# EAGLE schematic MagEnc2 (EAGLE 6.2)
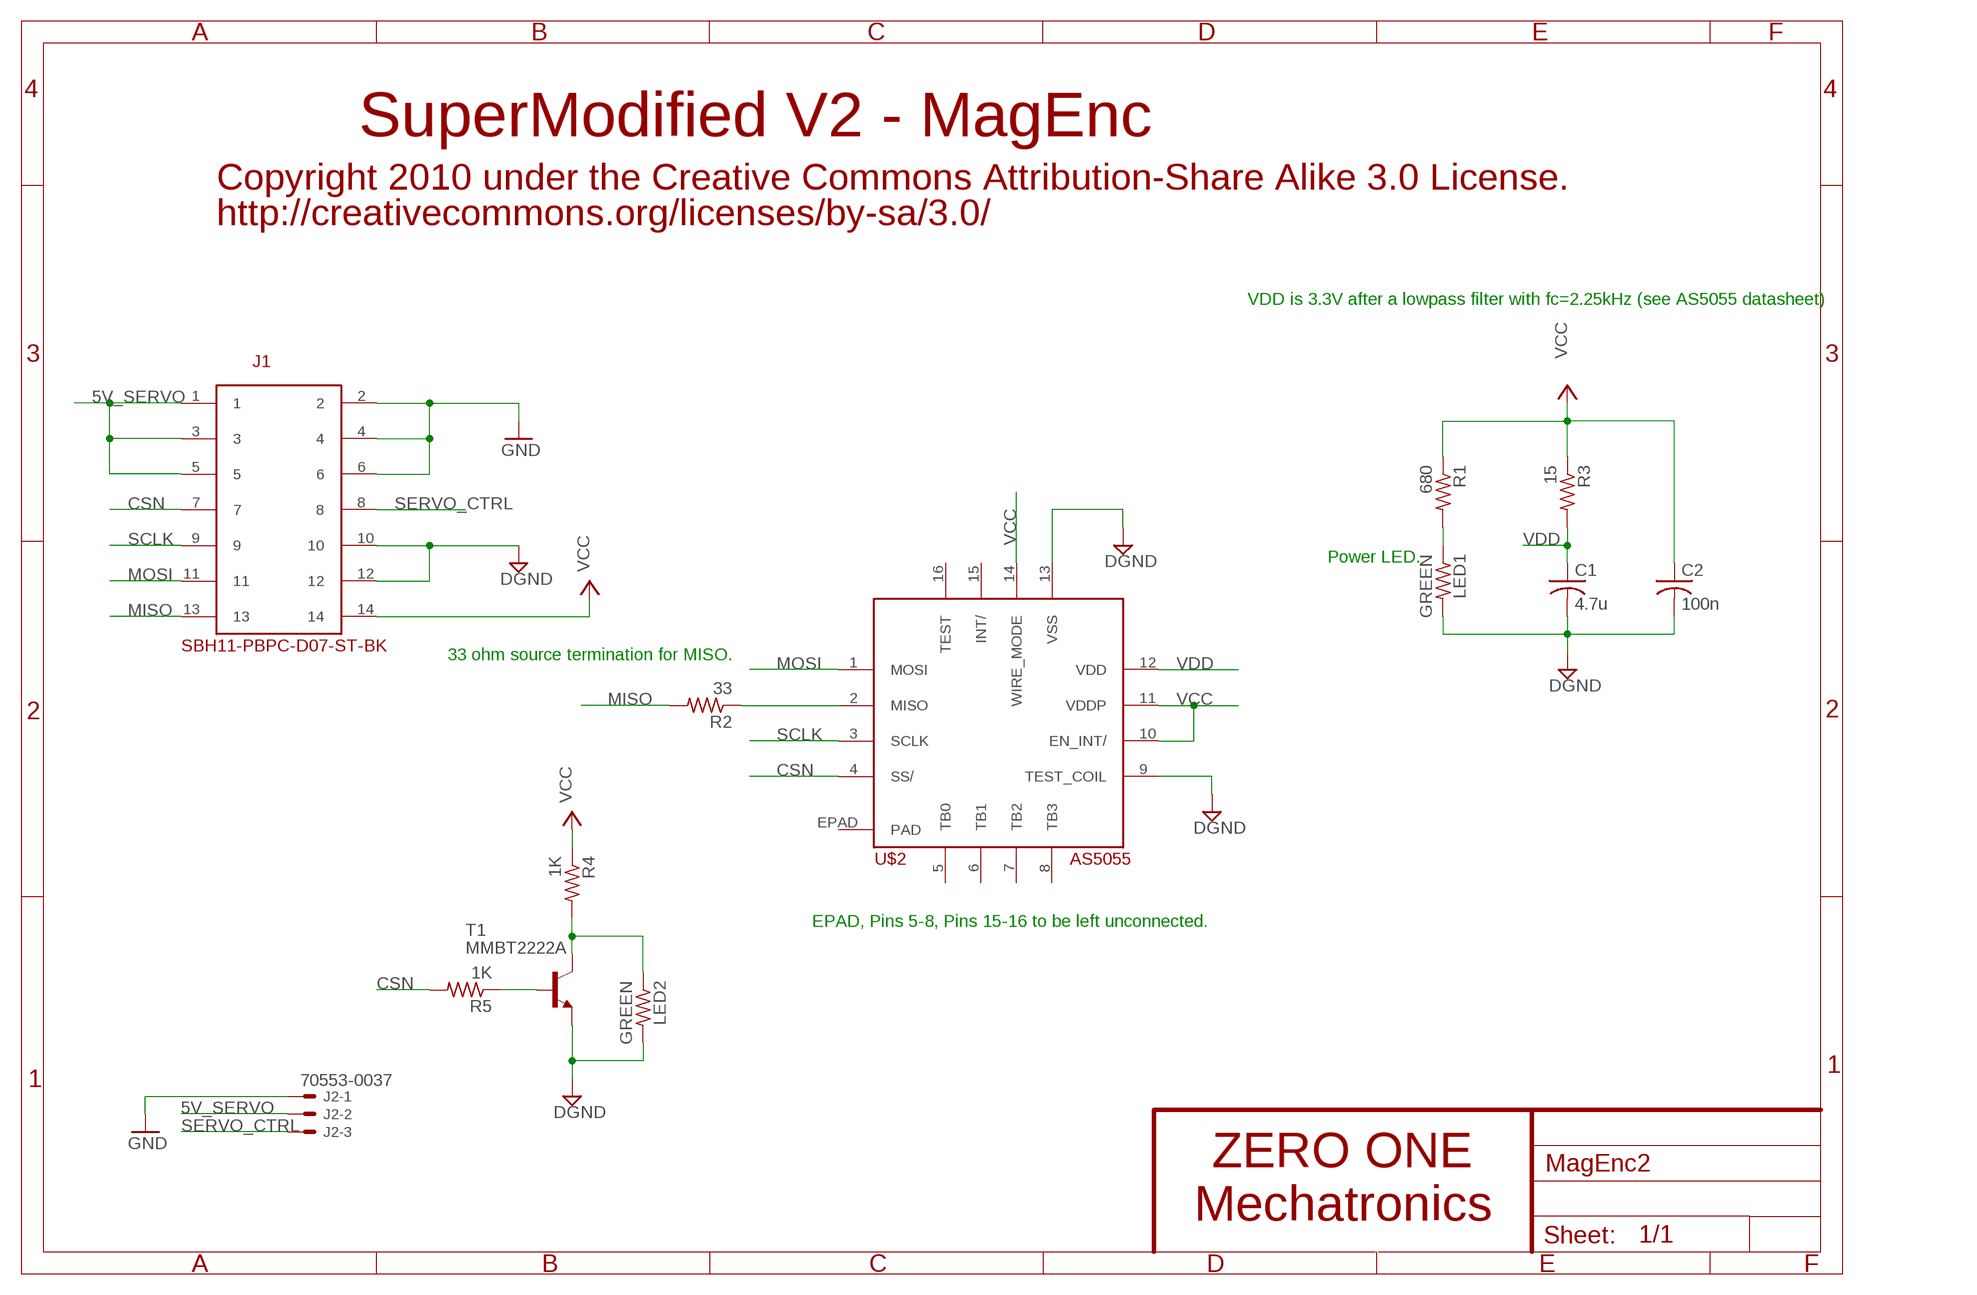
[diagram p0: schematic, sheet 1]

## Parts
C1  4.7u  C-USC0402  [C0402]
C2  100n  C-USC0402  [C0402]
J1  SBH11-PBPC-D07-ST-BK  [SBH11-PBPC-D07-ST-BK]
J2  70553-0037  C-GRID-03-70553  [70553-03]
LED1  GREEN  R-US_R0402  [R0402]
LED2  GREEN  R-US_R0402  [R0402]
R1  680  R-US_R0402  [R0402]
R2  33  R-US_R0402  [R0402]
R3  15  R-US_R0402  [R0402]
R4  1K  R-US_R0402  [R0402]
R5  1K  R-US_R0402  [R0402]
T1  MMBT2222A  MMBT2222ALT1-NPN-SOT23-BEC  [SOT23-BEC]
U$2  AS5055  [AS5055]

## Nets
5V_SERVO: J1.1 J1.3 J1.5 J2.2
CSN: J1.7 R5.2 U$2.4(SS/)
DGND: C1.2 C2.2 J1.10 J1.12 LED1.2 LED2.2 T1.E U$2.9(TEST_COIL) U$2.13(VSS)
GND: J1.2 J1.4 J1.6 J2.1
MISO: J1.13 R2.2
MOSI: J1.11 U$2.1(MOSI)
N$1: LED1.1 R1.2
N$2: LED2.1 R4.2 T1.C
N$3: R5.1 T1.B
N$4: R2.1 U$2.2(MISO)
SCLK: J1.9 U$2.3(SCLK)
SERVO_CTRL: J1.8 J2.3
VCC: C2.1 J1.14 R1.1 R3.1 R4.1 U$2.10(EN_INT/) U$2.11(VDDP) U$2.14(WIRE_MODE)
VDD: C1.1 R3.2 U$2.12(VDD)
Unconnected: U$2.5(TB0) U$2.6(TB1) U$2.7(TB2) U$2.8(TB3) U$2.15(INT/) U$2.16(TEST) U$2.EPAD(PAD)

## Notes on the sheet
- SuperModified V2 - MagEnc
- Copyright 2010 under the Creative Commons Attribution-Share Alike 3.0 License.
- http://creativecommons.org/licenses/by-sa/3.0/
- VDD is 3.3V after a lowpass filter with fc=2.25kHz (see AS5055 datasheet)
- Power LED.
- 33 ohm source termination for MISO.
- EPAD, Pins 5-8, Pins 15-16 to be left unconnected.
- ZERO ONE
- Mechatronics

## Library data of the parts
C1 C2 = resistor:C-US: CAPACITOR, American symbol
J1 = SBH11-PBPC-D07-ST-BK:SBH11-PBPC-D07-ST-BK
J2 = con-molex:C-GRID-03: CONNECTOR wire to board 2.54 mm (0.100") pitch header; OC_FARNELL: unknown; OC_NEWARK: unknown
LED1 LED2 R1-R5 = resistor:R-US_: RESISTOR, American symbol
T1 = transistor:*-NPN-: NPN Transistror BF959 corrected 2008.03.06
U$2 = AS5055:AS5055